# Altium schematic sheet 04_ARM_B.SchDoc: ARM Part B: Peripherals / System
size 381 x 266 mm; Organization: Meteroi; Address1: Room 428, 410 Guiping Rd.; Address2: Shanghai 200233, CHINA; SheetNumber: 4; SheetTotal: 11; PageSetup: Record=PageOptions|CenterHorizontal=True|CenterVertical=True|PrintScale=0.75|XCorrection=1.00|YCorrection=1.00|PrintKind=2|BorderSize=5000000|LeftOffset=0|BottomOffset=0|Orientation=2|PaperLength=1000|PaperWidth=1000|Scale=100|PaperSource=276|PrintQuality=-3|MediaType=1|DitherType=10|PaperKind=A4|PrintScaleMode=1
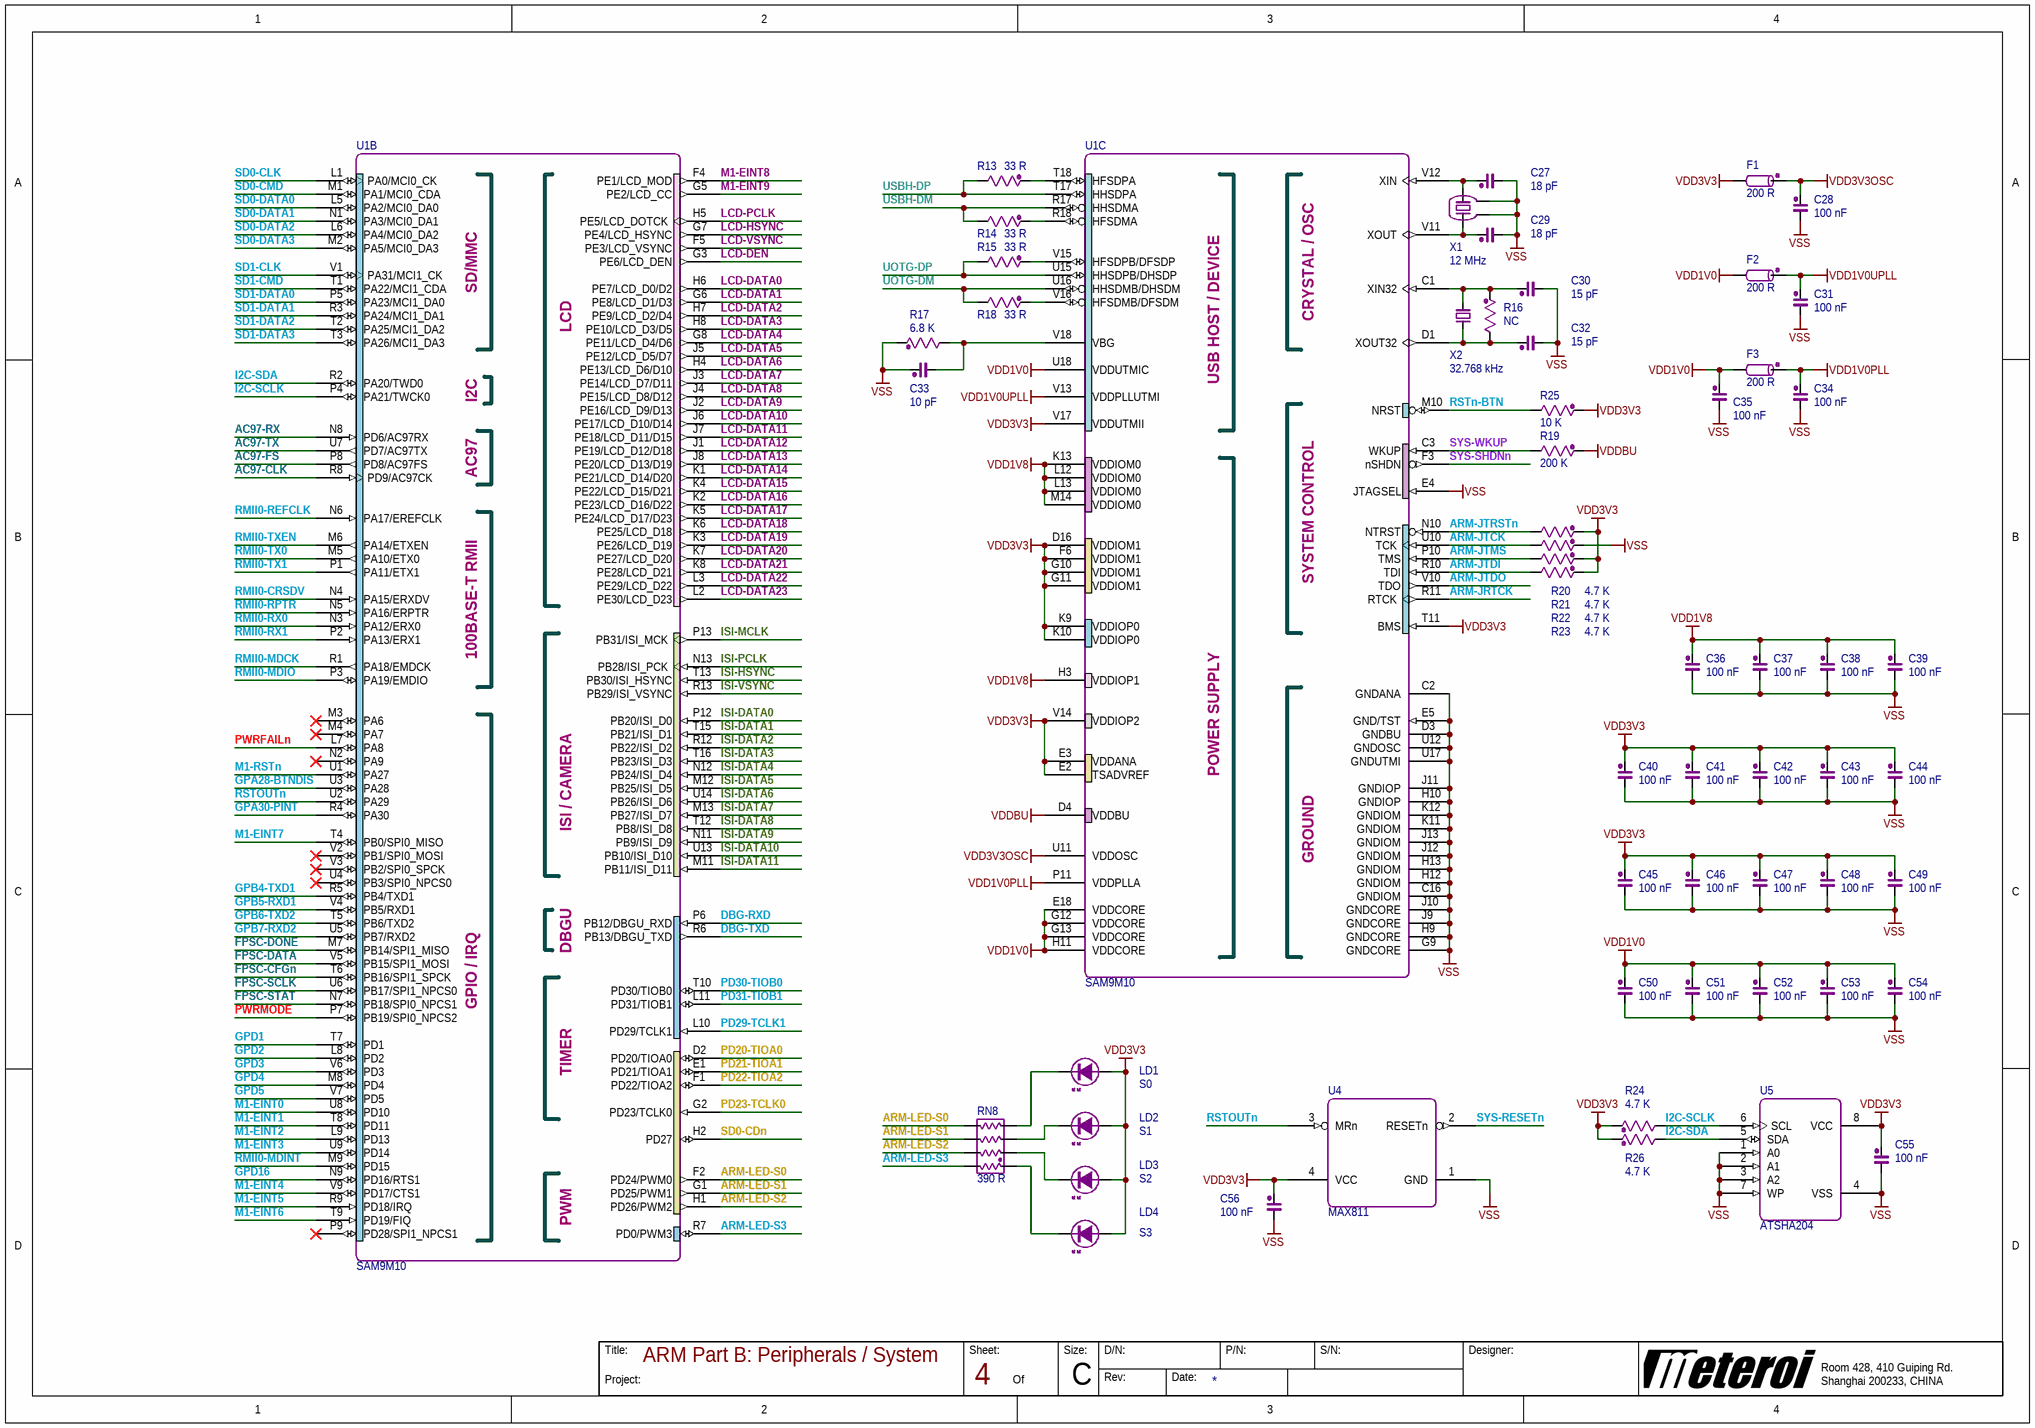
[diagram p0: 04_ARM_B.SchDoc]

## Parts
C27  18 pF  [0402A1]
C28  100 nF  [0402A1]
C29  18 pF  [0402A1]
C30  15 pF  [0402A1]
C31  100 nF  [0402A1]
C32  15 pF  [0402A1]
C33  10 pF  [0402A1]
C34  100 nF  [0402A1]
C35  100 nF  [0402A1]
C36  100 nF  [0402A1]
C37  100 nF  [0402A1]
C38  100 nF  [0402A1]
C39  100 nF  [0402A1]
C40  100 nF  [0402A1]
C41  100 nF  [0402A1]
C42  100 nF  [0402A1]
C43  100 nF  [0402A1]
C44  100 nF  [0402A1]
C45  100 nF  [0402A1]
C46  100 nF  [0402A1]
C47  100 nF  [0402A1]
C48  100 nF  [0402A1]
C49  100 nF  [0402A1]
C50  100 nF  [0402A1]
C51  100 nF  [0402A1]
C52  100 nF  [0402A1]
C53  100 nF  [0402A1]
C54  100 nF  [0402A1]
C55  100 nF  [0402A1]
C56  100 nF  [0402A1]
F1  200 R  [0402A3]
F2  200 R  [0402A3]
F3  200 R  [0402A3]
LD1  S0  [0603LD]
LD2  S1  [0603LD]
LD3  S2  [0603LD]
LD4  S3  [0603LD]
R13  33 R  [0402A2]
R14  33 R  [0402A2]
R15  33 R  [0402A2]
R16  NC  [0402A2]
R17  6.8 K  [0402A2]
R18  33 R  [0402A2]
R19  200 K  [0402A2]
R20  4.7 K  [0402A2]
R21  4.7 K  [0402A2]
R22  4.7 K  [0402A2]
R23  4.7 K  [0402A2]
R24  4.7 K  [0402A2]
R25  10 K  [0402A2]
R26  4.7 K  [0402A2]
RN8  390 R  [0402PR4]
U1  SAM9M10  [TFBGA-324]  (parts B,C of 3)
U4  MAX811  [SOT-143]
U5  ATSHA204  [SOIC-8S]
X1  12 MHz  [OSC_4A_S_3225]
X2  32.768 kHz  [OSC_2A_S_4918]

## Nets
VDD1V0: C35.2 C50.2 C51.2 C52.2 C53.2 C54.2 F2.1 F3.1 U1.E18(VDDCORE) U1.G12(VDDCORE) U1.G13(VDDCORE) U1.H11(VDDCORE) U1.U18(VDDUTMIC)
VDD1V0PLL: C34.2 F3.2 U1.P11(VDDPLLA)
VDD1V0UPLL: C31.2 F2.2 U1.V13(VDDPLLUTMI)
VDD1V8: C36.2 C37.2 C38.2 C39.2 U1.H3(VDDIOP1) U1.K13(VDDIOM0) U1.L12(VDDIOM0) U1.L13(VDDIOM0) U1.M14(VDDIOM0)
VDD3V3: C40.2 C41.2 C42.2 C43.2 C44.2 C45.2 C46.2 C47.2 C48.2 C49.2 C55.2 C56.2 F1.1 LD1.2 LD2.2 LD3.2 LD4.2 R20.2 R22.2 R23.2 R24.2 R25.2 R26.2 U1.D16(VDDIOM1) U1.E2(TSADVREF) U1.E3(VDDANA) U1.F6(VDDIOM1) U1.G10(VDDIOM1) U1.G11(VDDIOM1) U1.K9(VDDIOP0) U1.K10(VDDIOP0) U1.T11(BMS) U1.V14(VDDIOP2) U1.V17(VDDUTMII) U4.4(VCC) U5.8(VCC)
VDD3V3OSC: C28.2 F1.2 U1.U11(VDDOSC)
VDDBU: R19.2 U1.D4(VDDBU)
VSS: C27.1 C28.1 C29.1 C30.1 C31.1 C32.1 C33.2 C34.1 C35.1 C36.1 C37.1 C38.1 C39.1 C40.1 C41.1 C42.1 C43.1 C44.1 C45.1 C46.1 C47.1 C48.1 C49.1 C50.1 C51.1 C52.1 C53.1 C54.1 C55.1 C56.1 R17.2 R21.2 U1.C2(GNDANA) U1.C16(GNDIOM) U1.D3(GNDBU) U1.E4(JTAGSEL) U1.E5(GND/TST) U1.G9(GNDCORE) U1.H9(GNDCORE) U1.H10(GNDIOP) U1.H12(GNDIOM) U1.H13(GNDIOM) U1.J9(GNDCORE) U1.J10(GNDCORE) U1.J11(GNDIOP) U1.J12(GNDIOM) U1.J13(GNDIOM) U1.K11(GNDIOM) U1.K12(GNDIOM) U1.U12(GNDOSC) U1.U17(GNDUTMI) U4.1(GND) U5.1(A0) U5.2(A1) U5.3(A2) U5.4(VSS) U5.7(WP) X1.2 X1.4
AC97-CLK: U1.R8(PD9/AC97CK)
AC97-FS: U1.P8(PD8/AC97FS)
AC97-RX: U1.N8(PD6/AC97RX)
AC97-TX: U1.U7(PD7/AC97TX)
ARM-JRTCK: U1.R11(RTCK)
ARM-JTCK: R21.1 U1.U10(TCK)
ARM-JTDI: R23.1 U1.R10(TDI)
ARM-JTDO: U1.V10(TDO)
ARM-JTMS: R22.1 U1.P10(TMS)
ARM-JTRSTn: R20.1 U1.N10(NTRST)
ARM-LED-S0: RN8.8 U1.F2(PD24/PWM0)
ARM-LED-S1: RN8.6 U1.G1(PD25/PWM1)
ARM-LED-S2: RN8.4 U1.H1(PD26/PWM2)
ARM-LED-S3: RN8.2 U1.R7(PD0/PWM3)
DBG-RXD: U1.P6(PB12/DBGU_RXD)
DBG-TXD: U1.R6(PB13/DBGU_TXD)
FPSC-CFGn: U1.T6(PB16/SPI1_SPCK)
FPSC-DATA: U1.V5(PB15/SPI1_MOSI)
FPSC-DONE: U1.M7(PB14/SPI1_MISO)
FPSC-SCLK: U1.U6(PB17/SPI1_NPCS0)
FPSC-STAT: U1.N7(PB18/SPI0_NPCS1)
GPA28-BTNDIS: U1.U3(PA28)
GPA30-PINT: U1.R4(PA30)
GPB4-TXD1: U1.R5(PB4/TXD1)
GPB5-RXD1: U1.V4(PB5/RXD1)
GPB6-TXD2: U1.T5(PB6/TXD2)
GPB7-RXD2: U1.U5(PB7/RXD2)
GPD1: U1.T7(PD1)
GPD2: U1.L8(PD2)
GPD3: U1.V6(PD3)
GPD4: U1.M8(PD4)
GPD5: U1.V7(PD5)
GPD16: U1.N9(PD16/RTS1)
I2C-SCLK: R24.1 U1.P4(PA21/TWCK0) U5.6(SCL)
I2C-SDA: R26.1 U1.R2(PA20/TWD0) U5.5(SDA)
ISI-DATA0: U1.P12(PB20/ISI_D0)
ISI-DATA1: U1.T15(PB21/ISI_D1)
ISI-DATA2: U1.R12(PB22/ISI_D2)
ISI-DATA3: U1.T16(PB23/ISI_D3)
ISI-DATA4: U1.N12(PB24/ISI_D4)
ISI-DATA5: U1.M12(PB25/ISI_D5)
ISI-DATA6: U1.U14(PB26/ISI_D6)
ISI-DATA7: U1.M13(PB27/ISI_D7)
ISI-DATA8: U1.T12(PB8/ISI_D8)
ISI-DATA9: U1.N11(PB9/ISI_D9)
ISI-DATA10: U1.U13(PB10/ISI_D10)
ISI-DATA11: U1.M11(PB11/ISI_D11)
ISI-HSYNC: U1.T13(PB30/ISI_HSYNC)
ISI-MCLK: U1.P13(PB31/ISI_MCK)
ISI-PCLK: U1.N13(PB28/ISI_PCK)
ISI-VSYNC: U1.R13(PB29/ISI_VSYNC)
LCD-DATA0: U1.H6(PE7/LCD_D0/D2)
LCD-DATA1: U1.G6(PE8/LCD_D1/D3)
LCD-DATA2: U1.H7(PE9/LCD_D2/D4)
LCD-DATA3: U1.H8(PE10/LCD_D3/D5)
LCD-DATA4: U1.G8(PE11/LCD_D4/D6)
LCD-DATA5: U1.J5(PE12/LCD_D5/D7)
LCD-DATA6: U1.H4(PE13/LCD_D6/D10)
LCD-DATA7: U1.J3(PE14/LCD_D7/D11)
LCD-DATA8: U1.J4(PE15/LCD_D8/D12)
LCD-DATA9: U1.J2(PE16/LCD_D9/D13)
LCD-DATA10: U1.J6(PE17/LCD_D10/D14)
LCD-DATA11: U1.J7(PE18/LCD_D11/D15)
LCD-DATA12: U1.J1(PE19/LCD_D12/D18)
LCD-DATA13: U1.J8(PE20/LCD_D13/D19)
LCD-DATA14: U1.K1(PE21/LCD_D14/D20)
LCD-DATA15: U1.K4(PE22/LCD_D15/D21)
LCD-DATA16: U1.K2(PE23/LCD_D16/D22)
LCD-DATA17: U1.K5(PE24/LCD_D17/D23)
LCD-DATA18: U1.K6(PE25/LCD_D18)
LCD-DATA19: U1.K3(PE26/LCD_D19)
LCD-DATA20: U1.K7(PE27/LCD_D20)
LCD-DATA21: U1.K8(PE28/LCD_D21)
LCD-DATA22: U1.L3(PE29/LCD_D22)
LCD-DATA23: U1.L2(PE30/LCD_D23)
LCD-DEN: U1.G3(PE6/LCD_DEN)
LCD-HSYNC: U1.G7(PE4/LCD_HSYNC)
LCD-PCLK: U1.H5(PE5/LCD_DOTCK)
LCD-VSYNC: U1.F5(PE3/LCD_VSYNC)
M1-EINT0: U1.U8(PD10)
M1-EINT1: U1.T8(PD11)
M1-EINT2: U1.L9(PD13)
M1-EINT3: U1.U9(PD14)
M1-EINT4: U1.V9(PD17/CTS1)
M1-EINT5: U1.R9(PD18/IRQ)
M1-EINT6: U1.T9(PD19/FIQ)
M1-EINT7: U1.T4(PB0/SPI0_MISO)
M1-EINT8: U1.F4(PE1/LCD_MOD)
M1-EINT9: U1.G5(PE2/LCD_CC)
M1-RSTn: U1.U1(PA27)
PD20-TIOA0: U1.D2(PD20/TIOA0)
PD21-TIOA1: U1.E1(PD21/TIOA1)
PD22-TIOA2: U1.F1(PD22/TIOA2)
PD23-TCLK0: U1.G2(PD23/TCLK0)
PD29-TCLK1: U1.L10(PD29/TCLK1)
PD30-TIOB0: U1.T10(PD30/TIOB0)
PD31-TIOB1: U1.L11(PD31/TIOB1)
PWRFAILn: U1.L7(PA8)
PWRMODE: U1.P7(PB19/SPI0_NPCS2)
RMII0-CRSDV: U1.N4(PA15/ERXDV)
RMII0-MDCK: U1.R1(PA18/EMDCK)
RMII0-MDINT: U1.M9(PD15)
RMII0-MDIO: U1.P3(PA19/EMDIO)
RMII0-REFCLK: U1.N6(PA17/EREFCLK)
RMII0-RPTR: U1.N5(PA16/ERPTR)
RMII0-RX0: U1.N3(PA12/ERX0)
RMII0-RX1: U1.P2(PA13/ERX1)
RMII0-TX0: U1.M5(PA10/ETX0)
RMII0-TX1: U1.P1(PA11/ETX1)
RMII0-TXEN: U1.M6(PA14/ETXEN)
RSTn-BTN: R25.1 U1.M10(NRST)
RSTOUTn: U1.U2(PA29) U4.3(MRn)
SD0-CDn: U1.H2(PD27)
SD0-CLK: U1.L1(PA0/MCI0_CK)
SD0-CMD: U1.M1(PA1/MCI0_CDA)
SD0-DATA0: U1.L5(PA2/MCI0_DA0)
SD0-DATA1: U1.N1(PA3/MCI0_DA1)
SD0-DATA2: U1.L6(PA4/MCI0_DA2)
SD0-DATA3: U1.M2(PA5/MCI0_DA3)
SD1-CLK: U1.V1(PA31/MCI1_CK)
SD1-CMD: U1.T1(PA22/MCI1_CDA)
SD1-DATA0: U1.P5(PA23/MCI1_DA0)
SD1-DATA1: U1.R3(PA24/MCI1_DA1)
SD1-DATA2: U1.T2(PA25/MCI1_DA2)
SD1-DATA3: U1.T3(PA26/MCI1_DA3)
SYS-RESETn: U4.2(RESETn)
SYS-SHDNn: U1.F3(nSHDN)
SYS-WKUP: R19.1 U1.C3(WKUP)
UOTG-DM: R18.1 U1.U16(HHSDMB/DHSDM)
UOTG-DP: R15.1 U1.U15(HHSDPB/DHSDP)
USBH-DM: R14.1 U1.R17(HHSDMA)
USBH-DP: R13.1 U1.T17(HHSDPA)
NetC27_2: C27.2 U1.V12(XIN) X1.1
NetC29_2: C29.2 U1.V11(XOUT) X1.3
NetC30_2: C30.2 R16.2 U1.C1(XIN32) X2.2
NetC32_2: C32.2 R16.1 U1.D1(XOUT32) X2.1
NetC33_1: C33.1 R17.1 U1.V18(VBG)
NetLD1_1: LD1.1 RN8.7
NetLD2_1: LD2.1 RN8.5
NetLD3_1: LD3.1 RN8.3
NetLD4_1: LD4.1 RN8.1
NetR13_2: R13.2 U1.T18(HFSDPA)
NetR14_2: R14.2 U1.R18(HFSDMA)
NetR15_2: R15.2 U1.V15(HFSDPB/DFSDP)
NetR18_2: R18.2 U1.V16(HFSDMB/DFSDM)

Not connected (* = marked no-connect by the designer): U1 M3(PA6)* M4(PA7)* N2(PA9)* P9(PD28/SPI1_NPCS1)* U4(PB3/SPI0_NPCS0)* V2(PB1/SPI0_MOSI)* V3(PB2/SPI0_SPCK)*

## Notes on the sheet
- Title:
- Project:
- Sheet:
- Of
- Size:
- D/N:
- Rev:
- Date:
- P/N:
- S/N:
- Designer:
- C
- (in symbol SAM9M10, part B) SD/MMC; LCD; I2C; AC97; 100BASE-T RMII; ISI / CAMERA; DBGU; GPIO / IRQ; TIMER; PWM
- (in symbol SAM9M10, part C) CRYSTAL / OSC; USB HOST / DEVICE; SYSTEM CONTROL; POWER SUPPLY; GROUND

## Library data of the parts
C27-C56 = CAP: Normal Capacitor; PartNumber: 0; Vendor: muRata; Designer: shyul; PinCountSMD: 2; SerialNumber: 0; Publisher: Cowin; PCBMarker: Capacitor; Version: 1.0; VersionDate: 04-27-2011; PinCountHole: 0
  C27 C29: Value: 18 pF
  C28 C31 C34-C56: Value: 100 nF
  C30 C32: Value: 15 pF
  C33: Value: 10 pF
F1-F3 = BEAD: EMI Bead; PartNumber: BLM; SerialNumber: 0; Vendor: muRata; Designer: shyul; PinCountSMD: 2; PCBMarker: Bead; Version: 1.0; Value: 200 R; VersionDate: 04-28-2011; Publisher: Cowin; PinCountHole: 0
LD1-LD4 = LED: LED Single; PartNumber: 0; Value: Red; Designer: shyul; Vendor: Luckylight; PinCountSMD: 2; Status: S0; Version: 1.0; Publisher: Cowin; SerialNumber: 0; VersionDate: 04-27-2011; PCBMarker: LED; PinCountHole: 0
R13-R26 = RES: Normal Resistor; PartNumber: 0; Vendor: KOA; Designer: shyul; PinCountSMD: 2; SerialNumber: 0; Version: 1.0; VersionDate: 04-27-2011; PCBMarker: Resistor; Publisher: Cowin; PinCountHole: 0
  R13-R15 R18: Value: 33 R
  R16: Value: NC
  R17: Value: 6.8 K
  R19: Value: 200 K
  R20-R24 R26: Value: 4.7 K
  R25: Value: 10 K
RN8 = RES_N4: Resistor Array x4; PartNumber: YC124-JR-07390RL; SerialNumber: 0; Vendor: YAGEO; Designer: shyul; PinCountSMD: 8; Value: 390 R; Version: 1.0; VersionDate: 04-27-2011; Publisher: Cowin; PCBMarker: Resistor Array; PinCountHole: 0
U1 = SAM9M10: SAM9M10 Embedded Processor; PartNumber: AT91SAM9M10-CU; PCBMarker: ARM9; SerialNumber: 0; Vendor: Atmel; Designer: shyul; Version: 1.0; VersionDate: 2-15-2012; Value: SAM9M10; Publisher: Cowin
U4 = MAX811: Generic nReset; PartNumber: MAX811SEUS-T; Vendor: Maxim Semi.; SerialNumber: 0; PCBMarker: RESET; PinCountSMD: 4; Designer: shyul; Value: MAX811; Version: 1.0; VersionDate: 05-18-2011; Publisher: Cowin; PinCountHole: 0
U5 = ROM_I2C_A: Generic 24 Series I2C ROM; PartNumber: ATSHA204-SH-DA; Vendor: Atmel; SerialNumber: 0; PCBMarker: I2C ROM; PinCountSMD: 8; Designer: shyul; Version: 1.0; VersionDate: 05-08-2011; Publisher: Cowin; PinCountHole: 0; Value: ATSHA204
X1 = OSC_2B: Crystal; PartNumber: 0; Vendor: KDS; Designer: shyul; PinCountSMD: 4; Value: 12 MHz; SerialNumber: 0; Publisher: Cowin; PCBMarker: Crystal; Version: 1.0; VersionDate: 04-29-2011; PinCountHole: 0
X2 = OSC_2A: Crystal; PartNumber: 0; Vendor: KDS; Designer: shyul; PinCountSMD: 2; Value: 32.768 kHz; SerialNumber: 0; Publisher: Cowin; PCBMarker: Crystal; Version: 1.0; VersionDate: 04-29-2011; PinCountHole: 0